# Altium schematic sheet PwrSel.SchDoc
size A
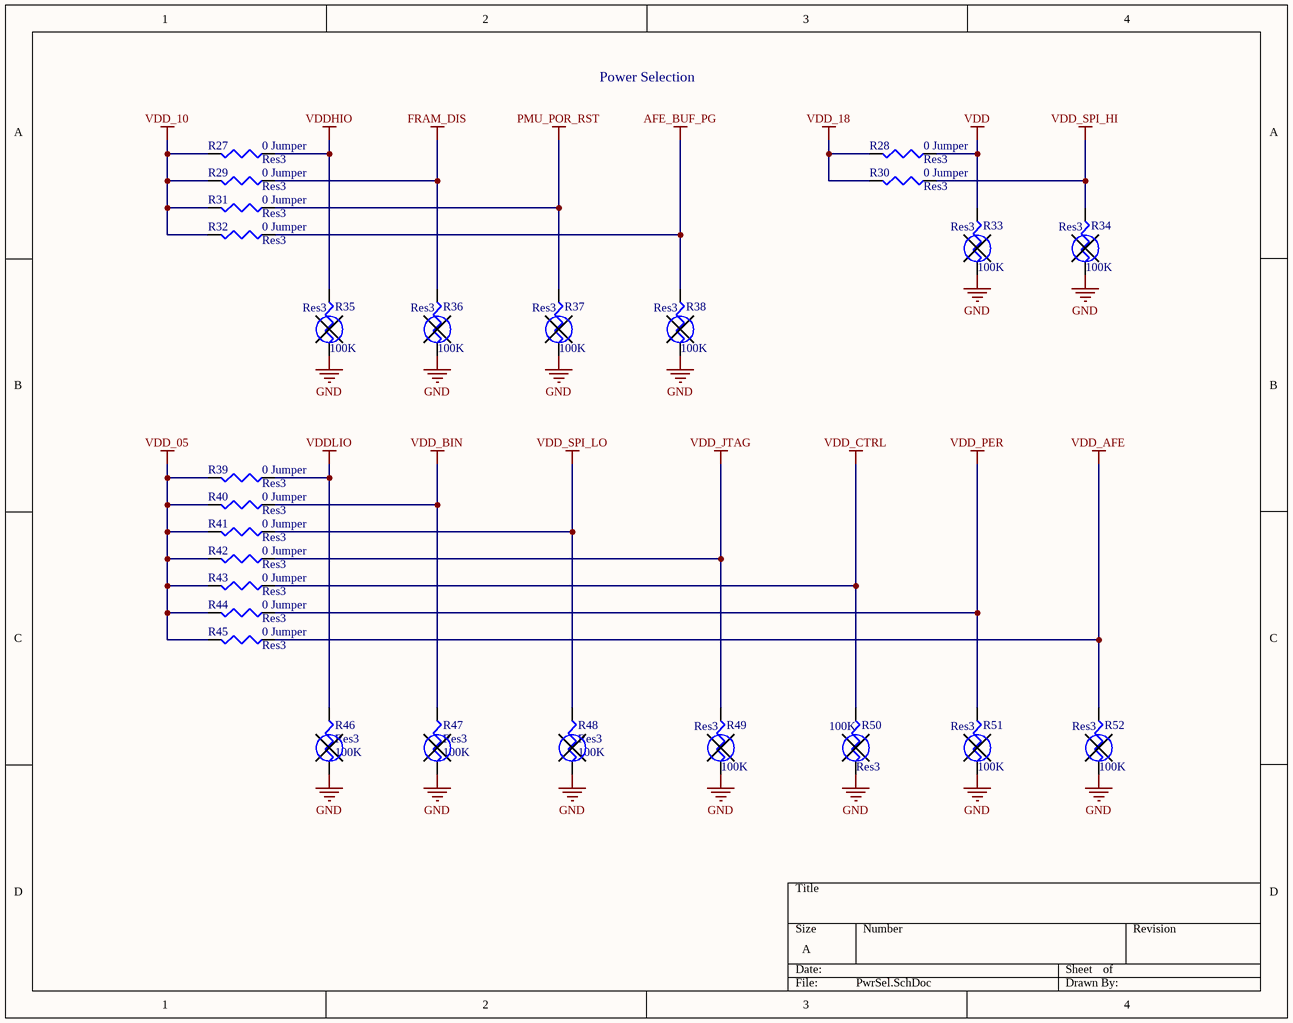
[diagram p0: PwrSel.SchDoc]

## Parts
R27  Res3  value 0 Jumper  [0402]
R28  Res3  value 0 Jumper  [0402]
R29  Res3  value 0 Jumper  [0402]
R30  Res3  value 0 Jumper  [0402]
R31  Res3  value 0 Jumper  [0402]
R32  Res3  value 0 Jumper  [0402]
R33  Res3  value 100K  [0402]
R34  Res3  value 100K  [0402]
R35  Res3  value 100K  [0402]
R36  Res3  value 100K  [0402]
R37  Res3  value 100K  [0402]
R38  Res3  value 100K  [0402]
R39  Res3  value 0 Jumper  [0402]
R40  Res3  value 0 Jumper  [0402]
R41  Res3  value 0 Jumper  [0402]
R42  Res3  value 0 Jumper  [0402]
R43  Res3  value 0 Jumper  [0402]
R44  Res3  value 0 Jumper  [0402]
R45  Res3  value 0 Jumper  [0402]
R46  Res3  value 100K  [0402]
R47  Res3  value 100K  [0402]
R48  Res3  value 100K  [0402]
R49  Res3  value 100K  [0402]
R50  Res3  value 100K  [0402]
R51  Res3  value 100K  [0402]
R52  Res3  value 100K  [0402]

## Nets
AFE_BUF_PG: R32.1 R38.1
FRAM_DIS: R29.1 R36.1
GND: R33.2 R34.2 R35.2 R36.2 R37.2 R38.2 R46.2 R47.2 R48.2 R49.2 R50.2 R51.2 R52.2
PMU_POR_RST: R31.1 R37.1
VDD: R28.1 R33.1
VDD_05: R39.2 R40.2 R41.2 R42.2 R43.2 R44.2 R45.2
VDD_10: R27.2 R29.2 R31.2 R32.2
VDD_18: R28.2 R30.2
VDD_AFE: R45.1 R52.1
VDD_BIN: R40.1 R47.1
VDD_CTRL: R43.1 R50.1
VDD_JTAG: R42.1 R49.1
VDD_PER: R44.1 R51.1
VDD_SPI_HI: R30.1 R34.1
VDD_SPI_LO: R41.1 R48.1
VDDHIO: R27.1 R35.1
VDDLIO: R39.1 R46.1

## Notes on the sheet
- Power Selection

## Library data of the parts
R27-R52 = Res3: Resistor; Published: 8-Jun-2000; LatestRevisionDate: 29-May-2009; LatestRevisionNote: IPC-7351 Footprint Added.; PackageReference: J1-0603; Publisher: Altium Limited; PackageDescription: Chip Resistor